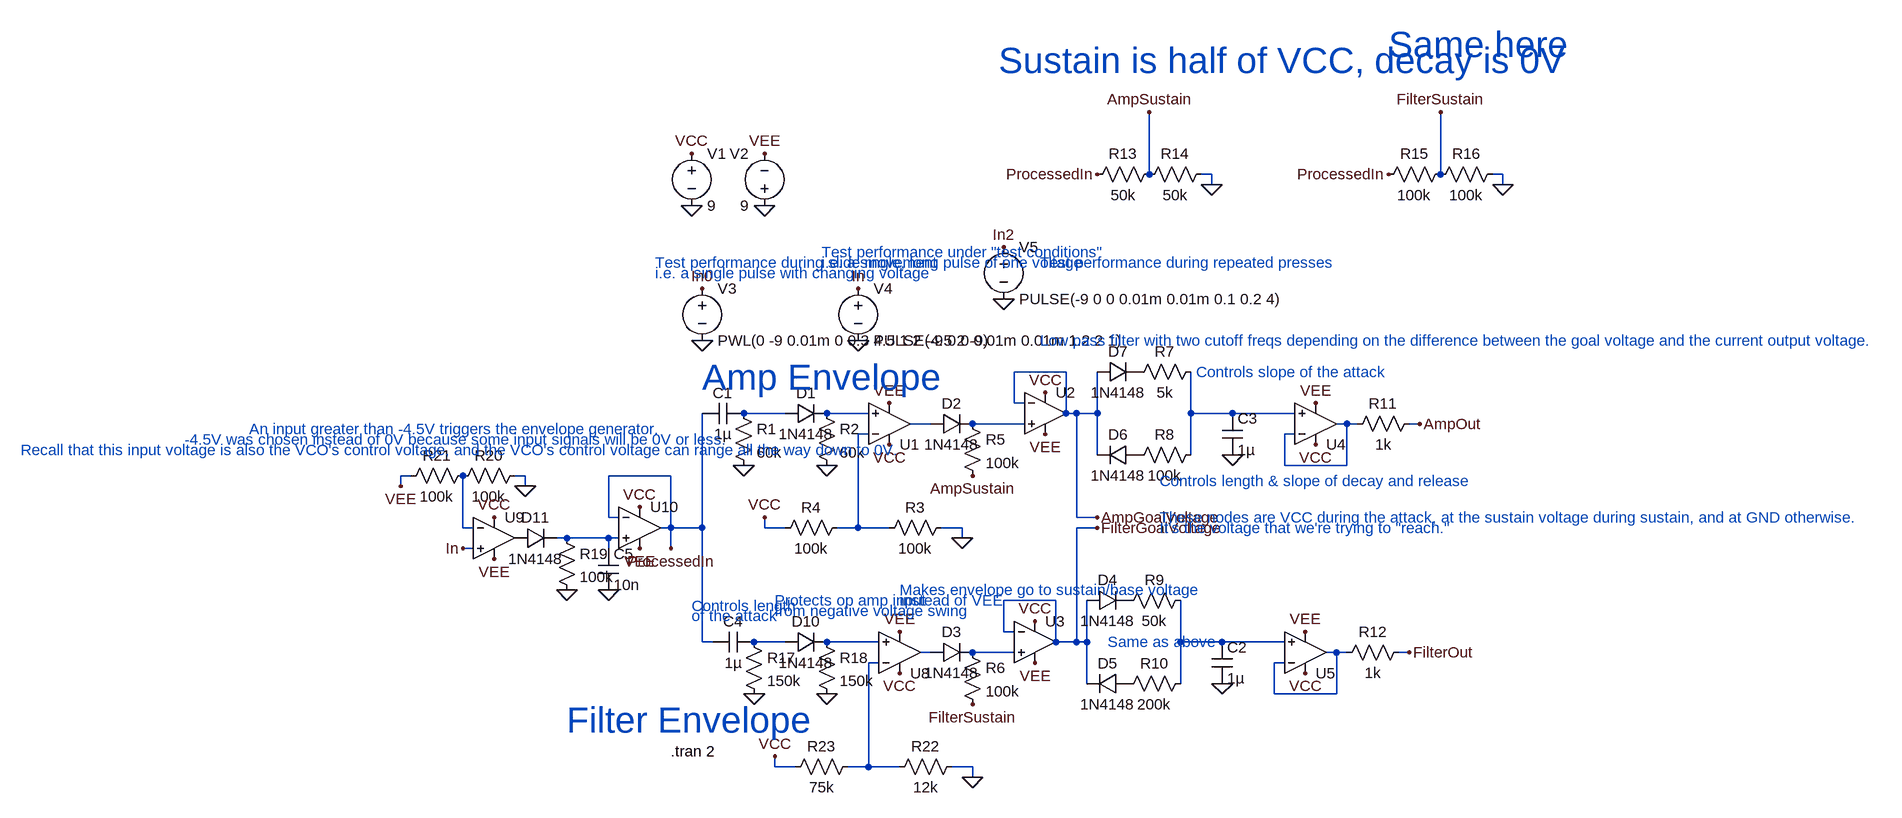
[diagram p0: schematic EnvelopeGenerator.asc]
EnvelopeGenerator.asc, the LTspice schematic file:
Version 4.1
SHEET 1 1356 680
WIRE 736 -384 736 -480
WIRE 832 -384 816 -384
WIRE 1184 -384 1184 -480
WIRE 1280 -384 1264 -384
WIRE 832 -368 832 -384
WIRE 1280 -368 1280 -384
WIRE 608 -80 528 -80
WIRE 528 -32 528 -80
WIRE 544 -32 528 -32
WIRE 176 -16 112 -16
WIRE 304 -16 240 -16
WIRE 608 -16 608 -80
WIRE 624 -16 608 -16
WIRE 656 -16 656 -80
WIRE 656 -16 624 -16
WIRE 800 -16 800 -80
WIRE 864 -16 800 -16
WIRE 960 -16 864 -16
WIRE 400 0 368 0
WIRE 544 0 464 0
WIRE 1040 0 1024 0
WIRE 1056 0 1040 0
WIRE 1152 0 1136 0
WIRE 304 16 288 16
WIRE 960 16 944 16
WIRE 656 48 656 -16
WIRE 800 48 800 -16
WIRE 944 64 944 16
WIRE 1040 64 1040 0
WIRE 1040 64 944 64
WIRE -400 80 -416 80
WIRE -224 80 -240 80
WIRE 0 80 -96 80
WIRE -416 96 -416 80
WIRE -224 96 -224 80
WIRE -96 144 -96 80
WIRE -80 144 -96 144
WIRE 624 144 624 -16
WIRE 656 144 624 144
WIRE -320 160 -320 80
WIRE -304 160 -320 160
WIRE 0 160 0 80
WIRE 0 160 -16 160
WIRE 48 160 48 -16
WIRE 48 160 0 160
WIRE 144 160 144 144
WIRE 176 160 144 160
WIRE 288 160 288 16
WIRE 288 160 256 160
WIRE 336 160 288 160
WIRE 448 160 416 160
WIRE 656 160 624 160
WIRE -160 176 -176 176
WIRE -96 176 -160 176
WIRE -80 176 -96 176
WIRE 448 176 448 160
WIRE -304 192 -320 192
WIRE -96 192 -96 176
WIRE 0 192 0 160
WIRE 592 272 512 272
WIRE 512 320 512 272
WIRE 528 320 512 320
WIRE 48 336 48 160
WIRE 64 336 48 336
WIRE 176 336 128 336
WIRE 320 336 240 336
WIRE 592 336 592 272
WIRE 624 336 624 160
WIRE 624 336 592 336
WIRE 640 336 640 272
WIRE 640 336 624 336
WIRE 784 336 784 272
WIRE 848 336 784 336
WIRE 944 336 848 336
WIRE 400 352 384 352
WIRE 528 352 464 352
WIRE 1024 352 1008 352
WIRE 1040 352 1024 352
WIRE 1136 352 1120 352
WIRE 320 368 304 368
WIRE 944 368 928 368
WIRE 640 400 640 336
WIRE 784 400 784 336
WIRE 928 416 928 368
WIRE 1024 416 1024 352
WIRE 1024 416 928 416
WIRE 160 528 160 512
WIRE 192 528 160 528
WIRE 304 528 304 368
WIRE 304 528 272 528
WIRE 352 528 304 528
WIRE 464 528 432 528
WIRE 464 544 464 528
FLAG 336 32 VCC
FLAG 336 -32 VEE
FLAG 32 -336 0
FLAG 144 -336 0
FLAG 144 -416 VEE
FLAG 32 -416 VCC
FLAG 464 80 AmpSustain
FLAG 464 432 FilterSustain
FLAG 576 -48 VCC
FLAG 560 304 VCC
FLAG 576 16 VEE
FLAG 560 368 VEE
FLAG 864 48 0
FLAG 848 400 0
FLAG 992 -32 VEE
FLAG 992 32 VCC
FLAG 976 320 VEE
FLAG 976 384 VCC
FLAG 1152 0 AmpOut
FLAG 1136 352 FilterOut
FLAG 832 -368 0
FLAG 736 -480 AmpSustain
FLAG 1280 -368 0
FLAG 1184 -480 FilterSustain
FLAG 352 384 VCC
FLAG 352 320 VEE
FLAG 288 -128 0
FLAG 288 -208 In
FLAG 48 -128 0
FLAG 48 -208 In0
FLAG -320 192 In
FLAG -272 144 VCC
FLAG -272 208 VEE
FLAG -48 128 VCC
FLAG -48 192 VEE
FLAG -160 256 0
FLAG 0 192 ProcessedIn
FLAG 656 -384 ProcessedIn
FLAG 1104 -384 ProcessedIn
FLAG -96 256 0
FLAG 112 64 0
FLAG 240 64 0
FLAG -224 96 0
FLAG -416 96 VEE
FLAG 128 416 0
FLAG 240 416 0
FLAG 448 176 0
FLAG 144 144 VCC
FLAG 656 144 AmpGoalVoltage
FLAG 656 160 FilterGoalVoltage
FLAG 512 -192 0
FLAG 512 -272 In2
FLAG 464 544 0
FLAG 160 512 VCC
SYMBOL cap 112 -32 R90
WINDOW 0 0 32 VBottom 2
WINDOW 3 32 32 VTop 2
SYMATTR InstName C1
SYMATTR Value 1µ
SYMBOL res 96 -32 R0
SYMATTR InstName R1
SYMATTR Value 60k
SYMBOL OpAmps\\UniversalOpAmp2 336 0 M180
SYMATTR InstName U1
SYMBOL voltage 32 -432 R0
WINDOW 123 0 0 Left 0
WINDOW 39 0 0 Left 0
SYMATTR InstName V1
SYMATTR Value 9
SYMBOL voltage 144 -320 R180
WINDOW 0 24 96 Left 2
WINDOW 3 24 16 Left 2
WINDOW 123 0 0 Left 0
WINDOW 39 0 0 Left 0
SYMATTR InstName V2
SYMATTR Value 9
SYMBOL diode 400 16 R270
WINDOW 0 32 32 VTop 2
WINDOW 3 0 32 VBottom 2
SYMATTR InstName D2
SYMATTR Value 1N4148
SYMBOL diode 400 368 R270
WINDOW 0 32 32 VTop 2
WINDOW 3 0 32 VBottom 2
SYMATTR InstName D3
SYMATTR Value 1N4148
SYMBOL res 448 -16 R0
SYMATTR InstName R5
SYMATTR Value 100k
SYMBOL res 448 336 R0
SYMATTR InstName R6
SYMATTR Value 100k
SYMBOL OpAmps\\UniversalOpAmp2 576 -16 R0
SYMATTR InstName U2
SYMBOL OpAmps\\UniversalOpAmp2 560 336 R0
SYMATTR InstName U3
SYMBOL diode 640 288 R270
WINDOW 0 32 32 VTop 2
WINDOW 3 0 32 VBottom 2
SYMATTR InstName D4
SYMATTR Value 1N4148
SYMBOL diode 704 384 R90
WINDOW 0 0 32 VBottom 2
WINDOW 3 32 32 VTop 2
SYMATTR InstName D5
SYMATTR Value 1N4148
SYMBOL diode 720 32 R90
WINDOW 0 0 32 VBottom 2
WINDOW 3 32 32 VTop 2
SYMATTR InstName D6
SYMATTR Value 1N4148
SYMBOL diode 656 -64 R270
WINDOW 0 32 32 VTop 2
WINDOW 3 0 32 VBottom 2
SYMATTR InstName D7
SYMATTR Value 1N4148
SYMBOL res 816 -96 R90
WINDOW 0 0 56 VBottom 2
WINDOW 3 32 56 VTop 2
SYMATTR InstName R7
SYMATTR Value 5k
SYMBOL res 816 32 R90
WINDOW 0 0 56 VBottom 2
WINDOW 3 32 56 VTop 2
SYMATTR InstName R8
SYMATTR Value 100k
SYMBOL res 800 256 R90
WINDOW 0 0 56 VBottom 2
WINDOW 3 32 56 VTop 2
SYMATTR InstName R9
SYMATTR Value 50k
SYMBOL res 800 384 R90
WINDOW 0 0 56 VBottom 2
WINDOW 3 32 56 VTop 2
SYMATTR InstName R10
SYMATTR Value 200k
SYMBOL cap 832 336 R0
SYMATTR InstName C2
SYMATTR Value 1µ
SYMBOL cap 848 -16 R0
SYMATTR InstName C3
SYMATTR Value 1µ
SYMBOL OpAmps\\UniversalOpAmp2 992 0 M180
SYMATTR InstName U4
SYMBOL OpAmps\\UniversalOpAmp2 976 352 M180
SYMATTR InstName U5
SYMBOL res 752 -400 R90
WINDOW 0 0 56 VBottom 2
WINDOW 3 32 56 VTop 2
SYMATTR InstName R13
SYMATTR Value 50k
SYMBOL res 832 -400 R90
WINDOW 0 0 56 VBottom 2
WINDOW 3 32 56 VTop 2
SYMATTR InstName R14
SYMATTR Value 50k
SYMBOL res 1200 -400 R90
WINDOW 0 0 56 VBottom 2
WINDOW 3 32 56 VTop 2
SYMATTR InstName R15
SYMATTR Value 100k
SYMBOL res 1280 -400 R90
WINDOW 0 0 56 VBottom 2
WINDOW 3 32 56 VTop 2
SYMATTR InstName R16
SYMATTR Value 100k
SYMBOL cap 128 320 R90
WINDOW 0 0 32 VBottom 2
WINDOW 3 32 32 VTop 2
SYMATTR InstName C4
SYMATTR Value 1µ
SYMBOL res 112 320 R0
SYMATTR InstName R17
SYMATTR Value 150k
SYMBOL diode 176 352 R270
WINDOW 0 32 32 VTop 2
WINDOW 3 0 32 VBottom 2
SYMATTR InstName D10
SYMATTR Value 1N4148
SYMBOL res 224 320 R0
SYMATTR InstName R18
SYMATTR Value 150k
SYMBOL OpAmps\\UniversalOpAmp2 352 352 M180
SYMATTR InstName U8
SYMBOL diode 176 0 R270
WINDOW 0 32 32 VTop 2
WINDOW 3 0 32 VBottom 2
SYMATTR InstName D1
SYMATTR Value 1N4148
SYMBOL res 224 -32 R0
SYMATTR InstName R2
SYMATTR Value 60k
SYMBOL res 1152 -16 R90
WINDOW 0 0 56 VBottom 2
WINDOW 3 32 56 VTop 2
SYMATTR InstName R11
SYMATTR Value 1k
SYMBOL res 1136 336 R90
WINDOW 0 0 56 VBottom 2
WINDOW 3 32 56 VTop 2
SYMATTR InstName R12
SYMATTR Value 1k
SYMBOL voltage 288 -224 R0
WINDOW 123 0 0 Left 0
WINDOW 39 0 0 Left 0
SYMATTR InstName V4
SYMATTR Value PULSE(-9 0 0 0.01m 0.01m 1.2 2 1)
SYMBOL voltage 48 -224 R0
WINDOW 123 0 0 Left 0
WINDOW 39 0 0 Left 0
SYMATTR InstName V3
SYMATTR Value PWL(0 -9 0.01m 0 0.3 4.5 1.2 -4.5 2 -9)
SYMBOL OpAmps\\UniversalOpAmp2 -272 176 R0
SYMATTR InstName U9
SYMBOL diode -240 192 R270
WINDOW 0 32 32 VTop 2
WINDOW 3 0 32 VBottom 2
SYMATTR InstName D11
SYMATTR Value 1N4148
SYMBOL OpAmps\\UniversalOpAmp2 -48 160 R0
SYMATTR InstName U10
SYMBOL res -176 160 R0
SYMATTR InstName R19
SYMATTR Value 100k
SYMBOL cap -112 192 R0
SYMATTR InstName C5
SYMATTR Value 10n
SYMBOL res -224 64 R90
WINDOW 0 0 56 VBottom 2
WINDOW 3 32 56 VTop 2
SYMATTR InstName R20
SYMATTR Value 100k
SYMBOL res -304 64 R90
WINDOW 0 0 56 VBottom 2
WINDOW 3 32 56 VTop 2
SYMATTR InstName R21
SYMATTR Value 100k
SYMBOL res 432 144 R90
WINDOW 0 0 56 VBottom 2
WINDOW 3 32 56 VTop 2
SYMATTR InstName R3
SYMATTR Value 100k
SYMBOL res 272 144 R90
WINDOW 0 0 56 VBottom 2
WINDOW 3 32 56 VTop 2
SYMATTR InstName R4
SYMATTR Value 100k
SYMBOL voltage 512 -288 R0
WINDOW 123 0 0 Left 0
WINDOW 39 0 0 Left 0
SYMATTR InstName V5
SYMATTR Value PULSE(-9 0 0 0.01m 0.01m 0.1 0.2 4)
SYMBOL res 448 512 R90
WINDOW 0 0 56 VBottom 2
WINDOW 3 32 56 VTop 2
SYMATTR InstName R22
SYMATTR Value 12k
SYMBOL res 288 512 R90
WINDOW 0 0 56 VBottom 2
WINDOW 3 32 56 VTop 2
SYMATTR InstName R23
SYMATTR Value 75k
TEXT 504 -560 Left 5 ;Sustain is half of VCC, decay is 0V
TEXT 48 -72 Left 5 ;Amp Envelope
TEXT -160 456 Left 5 ;Filter Envelope
TEXT 568 -128 Left 2 ;Low pass filter with two cutoff freqs depending on the difference between the goal voltage and the current output voltage.
TEXT 672 336 Left 2 ;Same as above
TEXT 0 504 Left 2 !.tran 2
TEXT -328 8 Center 2 ;An input greater than -4.5V triggers the envelope generator.
TEXT -328 24 Center 2 ;-4.5V was chosen instead of 0V because some input signals will be 0V or less.
TEXT -320 40 Center 2 ;Recall that this input voltage is also the VCO's control voltage, and the VCO's control voltage can range all the way down to 0V.
TEXT 808 -80 Left 2 ;Controls slope of the attack
TEXT 752 88 Left 2 ;Controls length & slope of decay and release
TEXT 32 280 Left 2 ;Controls length
TEXT 160 272 Left 2 ;Protects op amp input
TEXT 160 288 Left 2 ;from negative voltage swing
TEXT 32 296 Left 2 ;of the attack
TEXT 352 256 Left 2 ;Makes envelope go to sustain/base voltage
TEXT 352 272 Left 2 ;instead of VEE
TEXT 1104 -584 Left 5 ;Same here
TEXT 752 144 Left 2 ;These nodes are VCC during the attack, at the sustain voltage during sustain, and at GND otherwise.
TEXT 752 160 Left 2 ;It's the voltage that we're trying to "reach."
TEXT 568 -248 Left 2 ;Test performance during repeated presses
TEXT 232 -264 Left 2 ;Test performance under "test conditions"
TEXT 232 -248 Left 2 ;i.e. a single, long pulse of one voltage
TEXT -24 -248 Left 2 ;Test performance during slide movement
TEXT -24 -232 Left 2 ;i.e. a single pulse with changing voltage

The netlist it stands for:
* EnvelopeGenerator.asc
C1 N001 ProcessedIn 1µ
R1 N001 0 60k
X§U1 N002 N007 VCC VEE N004 level2 Avol=1Meg GBW=10Meg Slew=10Meg Ilimit=25m Rail=0 Vos=0 En=0 Enk=0 In=0 Ink=0 Rin=500Meg  ; pins In+ In- V+ V- OUT
V1 VCC 0 9
V2 0 VEE 9
D2 N004 N005 1N4148
D3 N013 N014 1N4148
R5 N005 AmpSustain 100k
R6 N014 FilterSustain 100k
X§U2 N005 AmpGoalVoltage VCC VEE AmpGoalVoltage level2 Avol=1Meg GBW=10Meg Slew=10Meg Ilimit=25m Rail=0 Vos=0 En=0 Enk=0 In=0 Ink=0 Rin=500Meg  ; pins In+ In- V+ V- OUT
X§U3 N014 FilterGoalVoltage VCC VEE FilterGoalVoltage level2 Avol=1Meg GBW=10Meg Slew=10Meg Ilimit=25m Rail=0 Vos=0 En=0 Enk=0 In=0 Ink=0 Rin=500Meg  ; pins In+ In- V+ V- OUT
D4 FilterGoalVoltage P001 1N4148
D5 P002 FilterGoalVoltage 1N4148
D6 P003 AmpGoalVoltage 1N4148
D7 AmpGoalVoltage P004 1N4148
R7 N003 P004 5k
R8 N003 P003 100k
R9 N012 P001 50k
R10 N012 P002 200k
C2 N012 0 1µ
C3 N003 0 1µ
X§U4 N003 N006 VCC VEE N006 level2 Avol=1Meg GBW=10Meg Slew=10Meg Ilimit=25m Rail=0 Vos=0 En=0 Enk=0 In=0 Ink=0 Rin=500Meg  ; pins In+ In- V+ V- OUT
X§U5 N012 N015 VCC VEE N015 level2 Avol=1Meg GBW=10Meg Slew=10Meg Ilimit=25m Rail=0 Vos=0 En=0 Enk=0 In=0 Ink=0 Rin=500Meg  ; pins In+ In- V+ V- OUT
R13 AmpSustain ProcessedIn 50k
R14 0 AmpSustain 50k
R15 FilterSustain ProcessedIn 100k
R16 0 FilterSustain 100k
C4 N010 ProcessedIn 1µ
R17 N010 0 150k
D10 N010 N011 1N4148
R18 N011 0 150k
X§U8 N011 N016 VCC VEE N013 level2 Avol=1Meg GBW=10Meg Slew=10Meg Ilimit=25m Rail=0 Vos=0 En=0 Enk=0 In=0 Ink=0 Rin=500Meg  ; pins In+ In- V+ V- OUT
D1 N001 N002 1N4148
R2 N002 0 60k
R11 AmpOut N006 1k
R12 FilterOut N015 1k
V4 In 0 PULSE(-9 0 0 0.01m 0.01m 1.2 2 1)
V3 In0 0 PWL(0 -9 0.01m 0 0.3 4.5 1.2 -4.5 2 -9)
X§U9 In N008 VCC VEE P005 level2 Avol=1Meg GBW=10Meg Slew=10Meg Ilimit=25m Rail=0 Vos=0 En=0 Enk=0 In=0 Ink=0 Rin=500Meg  ; pins In+ In- V+ V- OUT
D11 P005 N009 1N4148
X§U10 N009 ProcessedIn VCC VEE ProcessedIn level2 Avol=1Meg GBW=10Meg Slew=10Meg Ilimit=25m Rail=0 Vos=0 En=0 Enk=0 In=0 Ink=0 Rin=500Meg  ; pins In+ In- V+ V- OUT
R19 N009 0 100k
C5 N009 0 10n
R20 0 N008 100k
R21 N008 VEE 100k
R3 0 N007 100k
R4 N007 VCC 100k
V5 In2 0 PULSE(-9 0 0 0.01m 0.01m 0.1 0.2 4)
R22 0 N016 12k
R23 N016 VCC 75k
.model D D
.lib standard.dio
* Sustain is half of VCC, decay is 0V
* Amp Envelope
* Filter Envelope
* Low pass filter with two cutoff freqs depending on the difference between the goal voltage and the current output voltage.
* Same as above
.tran 2
* An input greater than -4.5V triggers the envelope generator.
* -4.5V was chosen instead of 0V because some input signals will be 0V or less.
* Recall that this input voltage is also the VCO's control voltage, and the VCO's control voltage can range all the way down to 0V.
* Controls slope of the attack
* Controls length & slope of decay and release
* Controls length
* Protects op amp input
* from negative voltage swing
* of the attack
* Makes envelope go to sustain/base voltage
* instead of VEE
* Same here
* These nodes are VCC during the attack, at the sustain voltage during sustain, and at GND otherwise.
* It's the voltage that we're trying to "reach."
* Test performance during repeated presses
* Test performance under "test conditions"
* i.e. a single, long pulse of one voltage
* Test performance during slide movement
* i.e. a single pulse with changing voltage
.lib UniversalOpAmp2.lib
.backanno
.end